# Altium schematic sheet I2C_Jog_Controller.SchDoc: Bluebell MFG PCB
size C; Author: AM; CompanyName: Cambridge Mobile Telematics; DrawnBy: A.Marles; Engineer: DM; Organization: Silver Bullet Technology; Address1: Schematic; Address2: 101 Main Street, 14th Floor; Address3: Cambridge, MA 02142; Address4: USA; DocumentNumber: 3; SheetNumber: 3; SheetTotal: 6
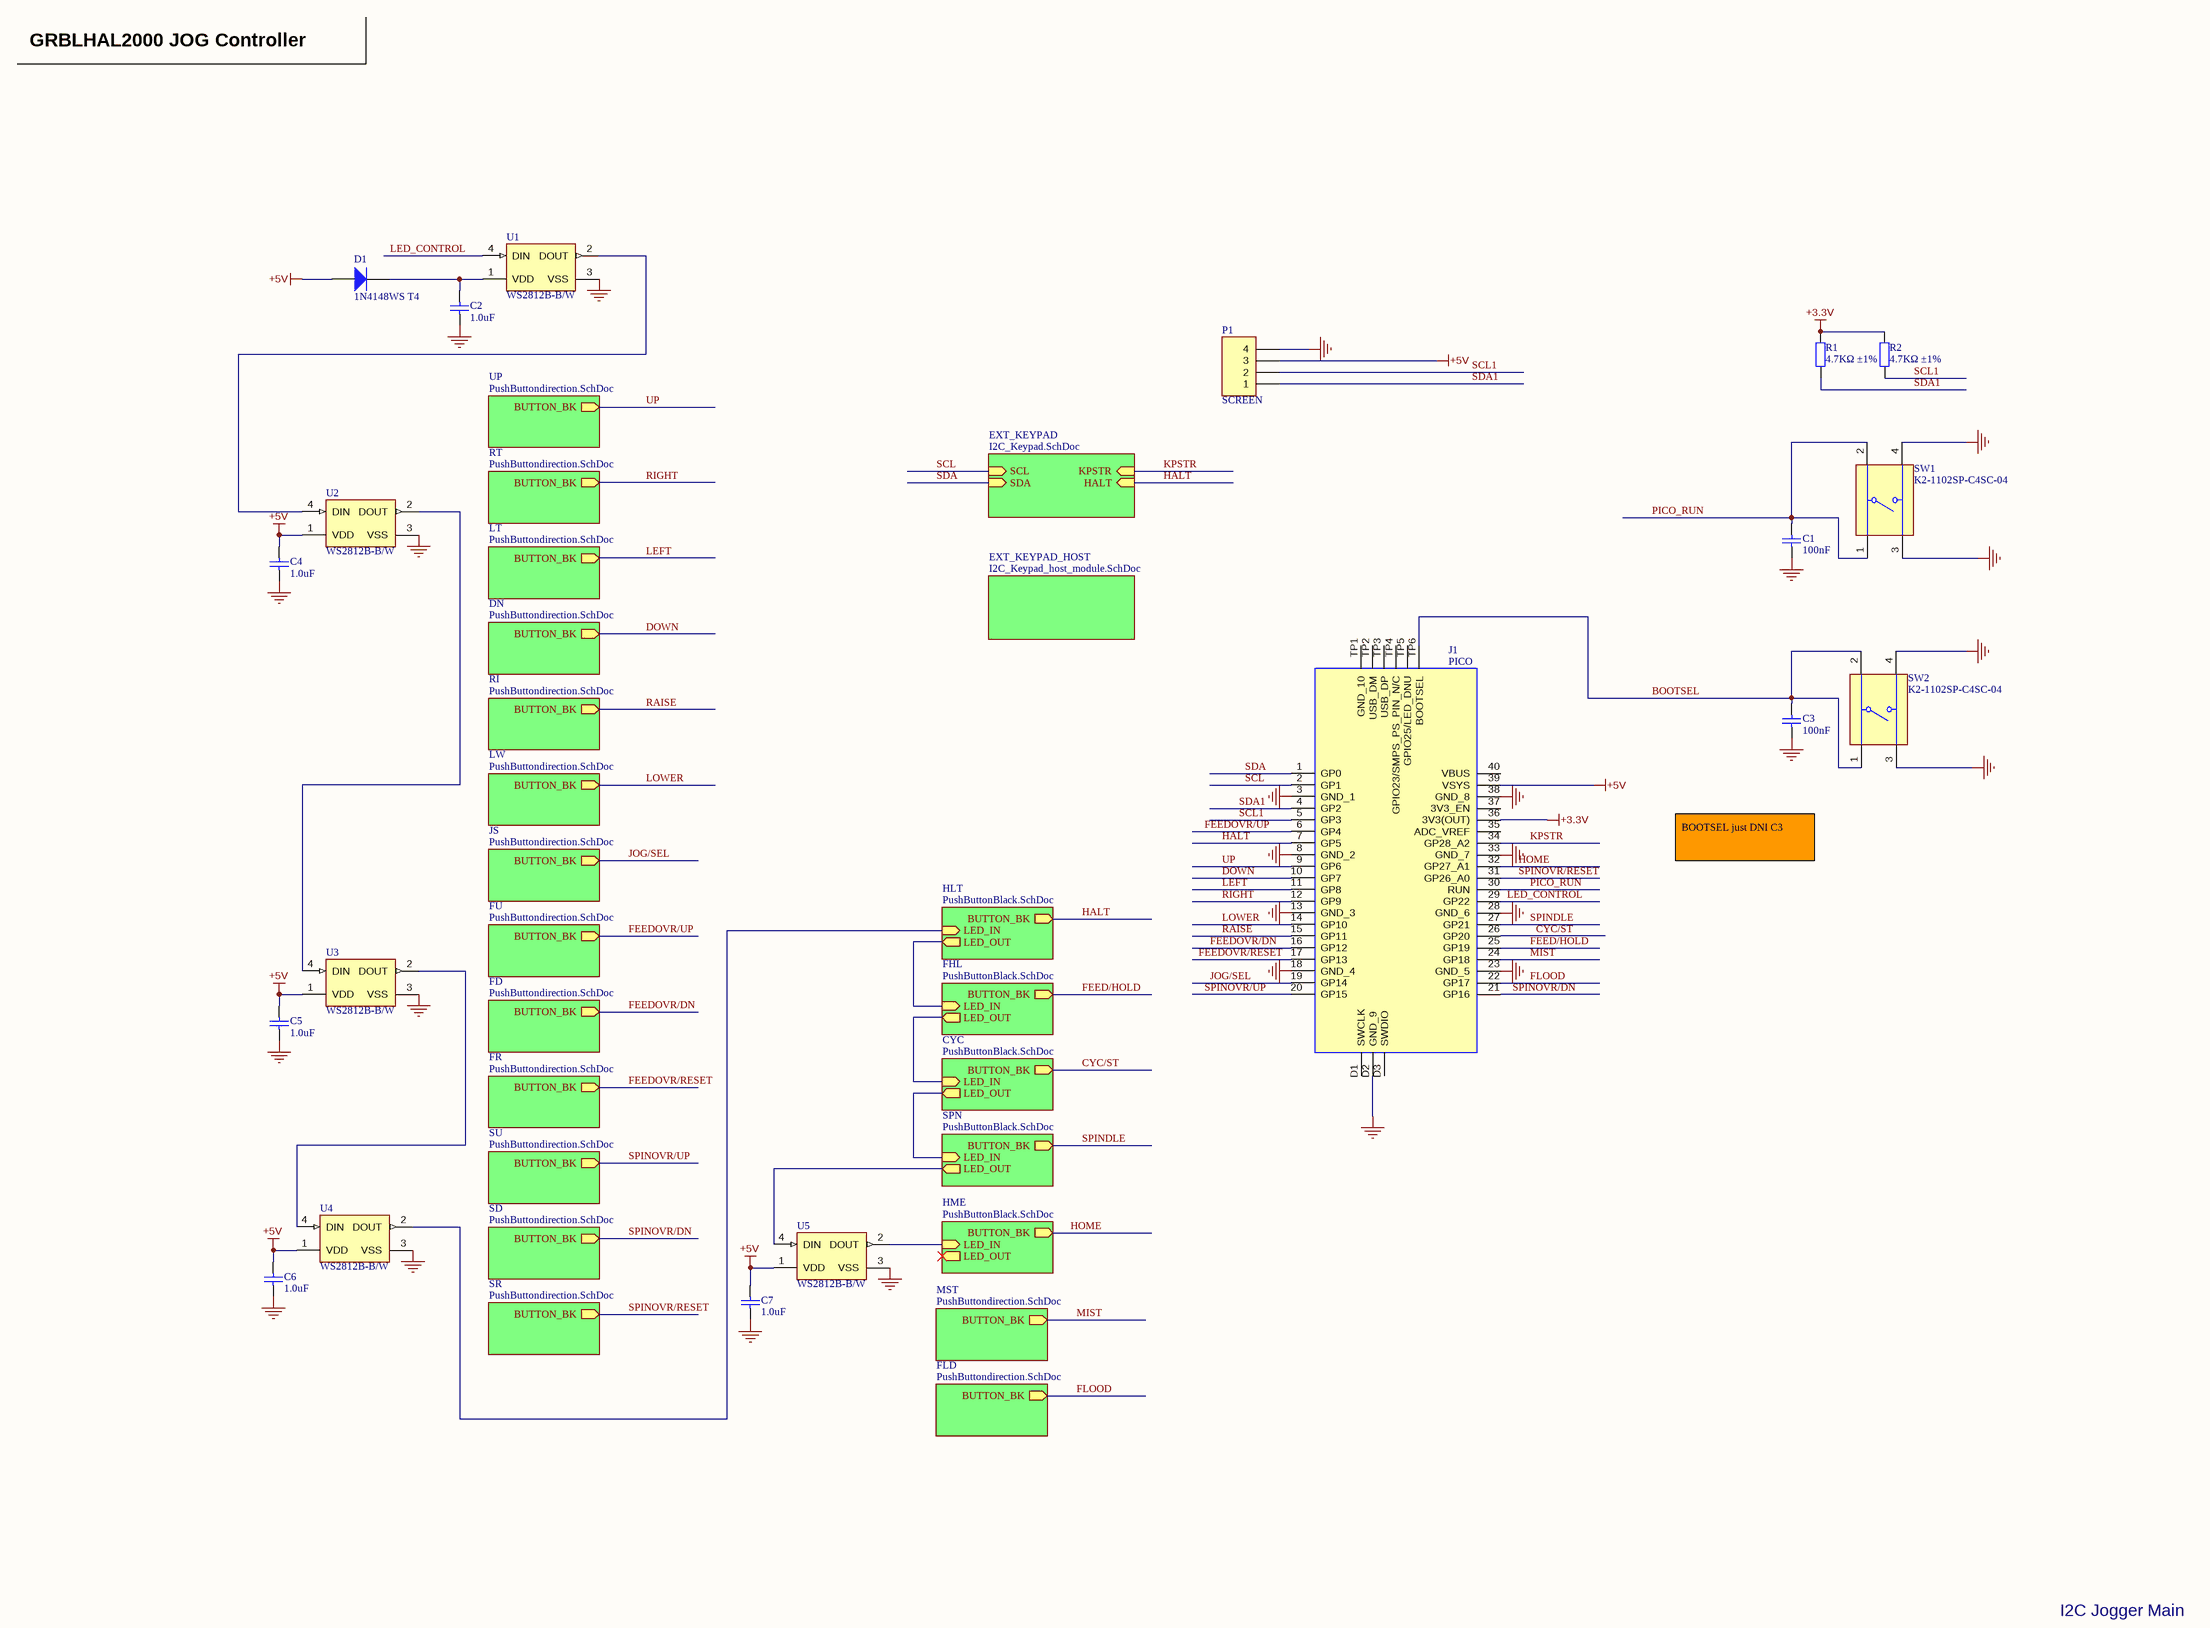
[diagram p0: I2C_Jog_Controller.SchDoc]

## Parts
C1  100nF  [0402_C]  (no BOM)
C2  1.0uF  [0402_C]
C3  100nF  [0402_C]  (no BOM)
C4  1.0uF  [0402_C]
C5  1.0uF  [0402_C]
C6  1.0uF  [0402_C]
C7  1.0uF  [0402_C]
D1  1N4148WS T4  [SOD-323]
J1  PICO  [PICO]  (no BOM)
P1  SCREEN  [HDR1X4]  (no BOM)
R1  4.7KΩ ±1%  [0402_R]
R2  4.7KΩ ±1%  [0402_R]
SW1  K2-1102SP-C4SC-04  [TECO-FSM4JSMATR_V]
SW2  K2-1102SP-C4SC-04  [TECO-FSM4JSMATR_V]
U1  WS2812B-B/W  [ADA-RGB-1655_V]
U2  WS2812B-B/W  [ADA-RGB-1655_V]
U3  WS2812B-B/W  [ADA-RGB-1655_V]
U4  WS2812B-B/W  [ADA-RGB-1655_V]
U5  WS2812B-B/W  [ADA-RGB-1655_V]

## Sub-sheets
CYC = PushButtonBlack.SchDoc: BUTTON_BK (out), LED_IN (in), LED_OUT (out)
DN = PushButtondirection.SchDoc: BUTTON_BK (out)
EXT_KEYPAD = I2C_Keypad.SchDoc: SCL (in), SDA (in), KPSTR (in), HALT (in)
EXT_KEYPAD_HOST = I2C_Keypad_host_module.SchDoc: no entries
FD = PushButtondirection.SchDoc: BUTTON_BK (out)
FHL = PushButtonBlack.SchDoc: BUTTON_BK (out), LED_IN (in), LED_OUT (out)
FLD = PushButtondirection.SchDoc: BUTTON_BK (out)
FR = PushButtondirection.SchDoc: BUTTON_BK (out)
FU = PushButtondirection.SchDoc: BUTTON_BK (out)
HLT = PushButtonBlack.SchDoc: BUTTON_BK (out), LED_IN (in), LED_OUT (out)
HME = PushButtonBlack.SchDoc: BUTTON_BK (out), LED_IN (in), LED_OUT (out)
JS = PushButtondirection.SchDoc: BUTTON_BK (out)
LT = PushButtondirection.SchDoc: BUTTON_BK (out)
LW = PushButtondirection.SchDoc: BUTTON_BK (out)
MST = PushButtondirection.SchDoc: BUTTON_BK (out)
RI = PushButtondirection.SchDoc: BUTTON_BK (out)
RT = PushButtondirection.SchDoc: BUTTON_BK (out)
SD = PushButtondirection.SchDoc: BUTTON_BK (out)
SPN = PushButtonBlack.SchDoc: BUTTON_BK (out), LED_IN (in), LED_OUT (out)
SR = PushButtondirection.SchDoc: BUTTON_BK (out)
SU = PushButtondirection.SchDoc: BUTTON_BK (out)
UP = PushButtondirection.SchDoc: BUTTON_BK (out)

## Nets
+3.3V: J1.36(3V3(OUT)) R1.2 R2.2
+5V: C4.2 C5.2 C6.2 C7.2 D1.1(A) J1.39(VSYS) P1.3 U2.1(VDD) U3.1(VDD) U4.1(VDD) U5.1(VDD)
GND: C1.1 C2.1 C3.1 C4.1 C5.1 C6.1 C7.1 J1.3(GND_1) J1.8(GND_2) J1.13(GND_3) J1.18(GND_4) J1.23(GND_5) J1.28(GND_6) J1.33(GND_7) J1.38(GND_8) J1.D2(GND_9) P1.4 SW1.3 SW1.4 SW2.3 SW2.4 U1.3(VSS) U2.3(VSS) U3.3(VSS) U4.3(VSS) U5.3(VSS)
BOOTSEL: C3.2 J1.TP6(BOOTSEL) SW2.1 SW2.2
CYC/ST: J1.26(GP20) ; sheet CYC/BUTTON_BK
DOWN: J1.10(GP7) ; sheet DN/BUTTON_BK
FEED/HOLD: J1.25(GP19) ; sheet FHL/BUTTON_BK
FEEDOVR/DN: J1.16(GP12) ; sheet FD/BUTTON_BK
FEEDOVR/RESET: J1.17(GP13) ; sheet FR/BUTTON_BK
FEEDOVR/UP: J1.6(GP4) ; sheet FU/BUTTON_BK
FLOOD: J1.22(GP17) ; sheet FLD/BUTTON_BK
HALT: J1.7(GP5) ; sheet EXT_KEYPAD/HALT, sheet HLT/BUTTON_BK
HOME: J1.32(GP27_A1) ; sheet HME/BUTTON_BK
JOG/SEL: J1.19(GP14) ; sheet JS/BUTTON_BK
KPSTR: J1.34(GP28_A2) ; sheet EXT_KEYPAD/KPSTR
LED_CONTROL: J1.29(GP22) U1.4(DIN)
LEFT: J1.11(GP8) ; sheet LT/BUTTON_BK
LOWER: J1.14(GP10) ; sheet LW/BUTTON_BK
MIST: J1.24(GP18) ; sheet MST/BUTTON_BK
PICO_RUN: C1.2 J1.30(RUN) SW1.1 SW1.2
RAISE: J1.15(GP11) ; sheet RI/BUTTON_BK
RIGHT: J1.12(GP9) ; sheet RT/BUTTON_BK
SCL: J1.2(GP1) ; sheet EXT_KEYPAD/SCL
SCL1: J1.5(GP3) P1.2 R2.1
SDA: J1.1(GP0) ; sheet EXT_KEYPAD/SDA
SDA1: J1.4(GP2) P1.1 R1.1
SPINDLE: J1.27(GP21) ; sheet SPN/BUTTON_BK
SPINOVR/DN: J1.21(GP16) ; sheet SD/BUTTON_BK
SPINOVR/RESET: J1.31(GP26_A0) ; sheet SR/BUTTON_BK
SPINOVR/UP: J1.20(GP15) ; sheet SU/BUTTON_BK
UP: J1.9(GP6) ; sheet UP/BUTTON_BK
NetC2_2: C2.2 D1.2(K) U1.1(VDD)
NetU1_2: U1.2(DOUT) U2.4(DIN)
NetU2_2: U2.2(DOUT) U3.4(DIN)
NetU3_2: U3.2(DOUT) U4.4(DIN)
NetU4_2: U4.2(DOUT) ; sheet HLT/LED_IN
NetU5_2: U5.2(DOUT) ; sheet HME/LED_IN
NetU5_4: U5.4(DIN) ; sheet SPN/LED_OUT
(unnamed): sheet SPN/LED_IN, sheet CYC/LED_OUT
(unnamed): sheet CYC/LED_IN, sheet FHL/LED_OUT
(unnamed): sheet FHL/LED_IN, sheet HLT/LED_OUT

Not connected (* = marked no-connect by the designer): J1 35(ADC_VREF) 37(3V3_EN) 40(VBUS) D1(SWCLK) D3(SWDIO) TP1(GND_10) TP2(USB_DM) TP3(USB_DP) TP4(GPIO23/SMPS_PS_PIN_N/C) TP5(GPIO25/LED_DNU)

## Notes on the sheet
- GRBLHAL2000 JOG Controller
- BOOTSEL just DNI C3
- I2C Jogger Main
- Expatria Technologies
- SHEET
- PROJECT
- REV
- 1136 Glade Court
- Port Coquitlam, BC V3B 1R5
- EMAIL: INFO@EXPATRIA.CA
- SIZE
- ENGR
- C
- MODIFIED
- DOCUMENT
- /
- Copyright Expatria Technologies 2021.  This document describes Open Hardware and is licensed under the CERN-OHL-P  v2.  No warranty is implied or expressed.

## Library data of the parts
C1 C3 = 0402 100nF (104) 10% 16V: Chip capacitors; Manufacturer: Samsung Electro-Mechanics; PartNumber: CL05B104KO5NNNC; Tolerance: 10%; Voltage: 16V; ComponentLink1Description: Supplier link; ComponentLink1URL: http://www.szlcsc.com/product/details_1877.html; Package: 0402; Supplier: LC; SuppliersPartNumber: C1525; Capacitance: 100nF
C2 C4-C7 = 0402 1.0uF (105) 10% 25V: Chip capacitor; Manufacturer: Samsung Electro-Mechanics; PartNumber: CL05A105KA5NQNC; Capacitance: 1uF; Tolerance: 10%; Voltage: 25V; ComponentLink1Description: Supplier link; ComponentLink1URL: http://www.szlcsc.com/product/details_53938.html; Package: 0402; Supplier: LC; SuppliersPartNumber: C52923
D1 = SOD-323 1N4148WS T4: 二极管; ComponentLink1Description: 供应商链接; ComponentLink1URL: http://www.szlcsc.com/product/details_2485.html; Package: SOD-323; Supplier: LC; SuppliersPartNumber: C2128
J1 = PICO: Connector; Manufacturer_Name: RASPBERRY-PI; Datasheet Link: https://datasheets.raspberrypi.org/pico/pico_datasheet.pdf; Height: 1mm; Manufacturer_Part_Number: PICO
P1 = Header 4: Header, 4-Pin; LatestRevisionDate: 17-Jul-2002; LatestRevisionNote: Re-released for DXP Platform.; Publisher: Altium Limited
R1 R2 = 0402 4.7K (4701) 1%: Chip resistor; Manufacturer: Uniroyal Elec; PartNumber: 0402WGF4701TCE; Power: 1/16W; ComponentLink1Description: Supplier link; ComponentLink1URL: http://www.szlcsc.com/product/details_26643.html; Package: 0402; Supplier: LC; SuppliersPartNumber: C25900; Resistance: 4.7KΩ; Tolerance: 1%
SW1 SW2 = CMP-2000-07486-1: Top Actuated 50mA @ 12VDC Round Button SPST 6*6mm Tactile Switches ROHS; SuppliersPartNumber: C127509; Package: SMD-4_6.0x6.0x4.5P
U1-U5 = CMP-2000-05026-1: Intelligent Control LED Integrated Light Source, 3.5 to 5.3 V, -25 to 80 degC, 4-Pin SMD, RoHS, Tape and Reel; Manufacturer: Worldsemi; Package Description: 4-Pin Surface Mount Device, Body 5 x 5 mm; SuppliersPartNumber: C2761795; Part_Number: WS2812B-B/W